# EAGLE design Triple Micro Shield (EAGLE 9.6.2)
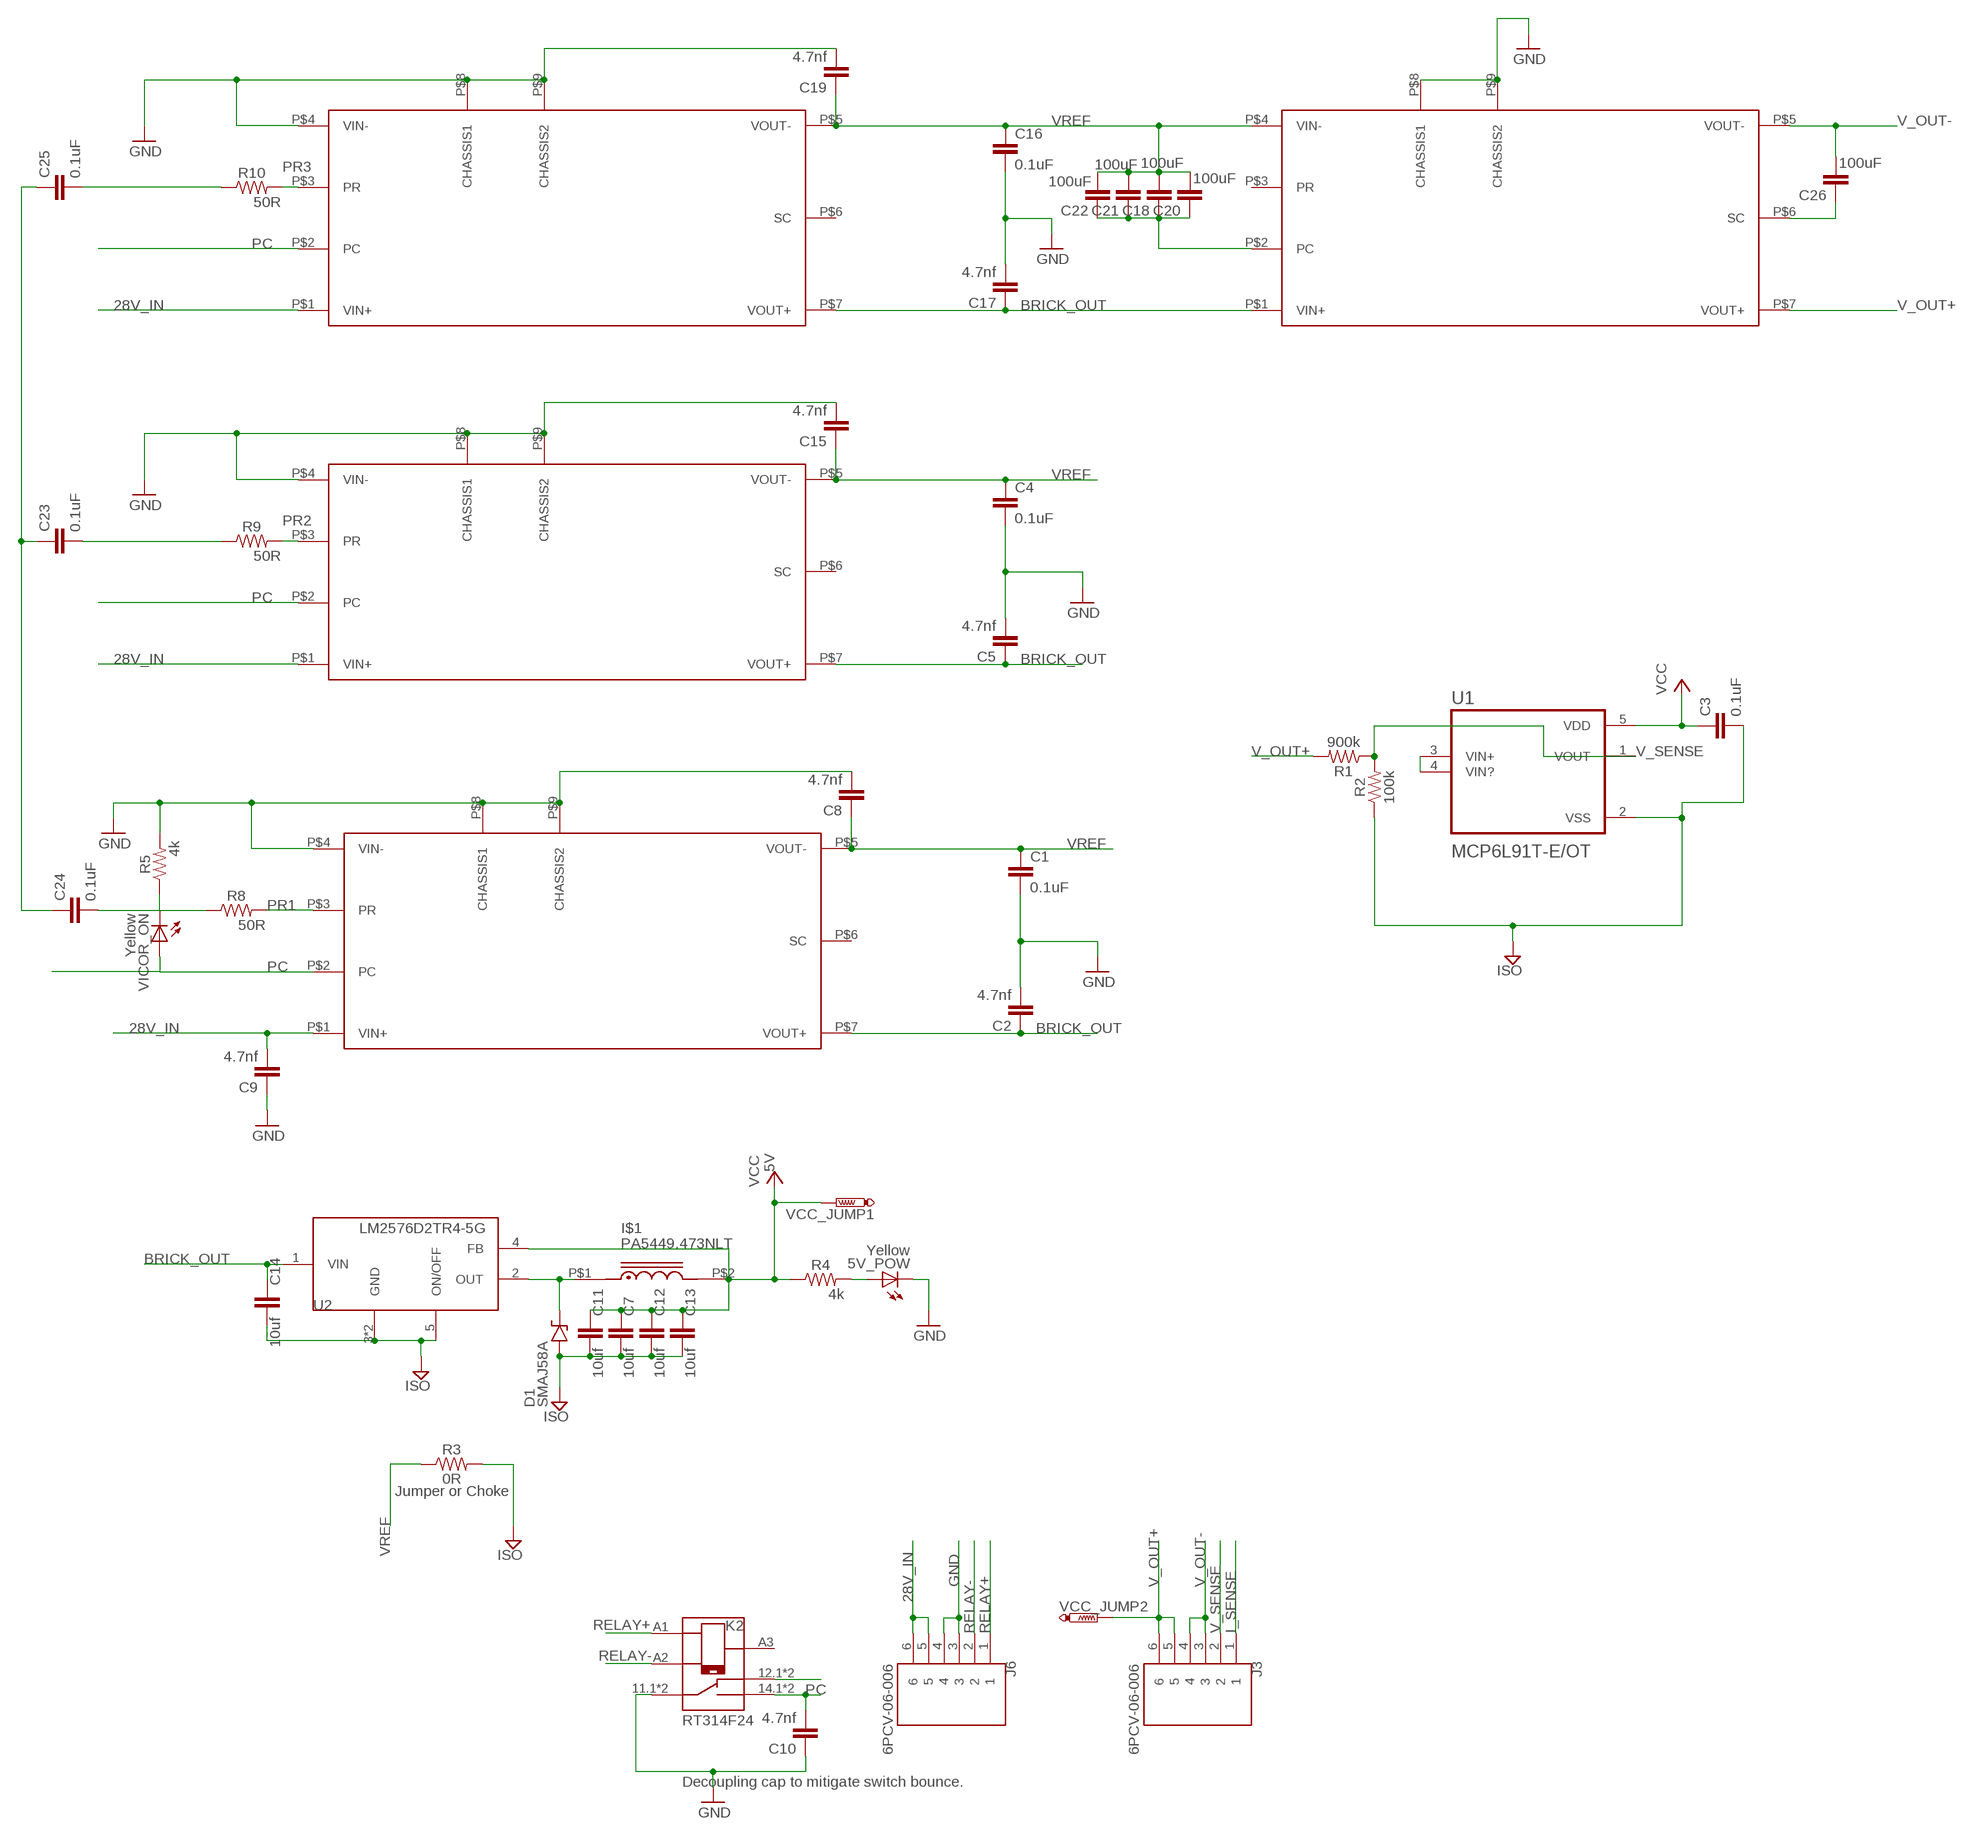
[diagram p0: schematic, sheet 1]

## Parts
5V_POW  Yellow  0044_KPT-2012YC  [CHIPLED_0805]
C1  0.1uF  5.6NF/5600PF_0603_50V_5%  [0603]
C2  4.7nf  5.6NF/5600PF_0603_50V_5%  [0603]
C3  0.1uF  5.6NF/5600PF_0603_50V_5%  [0603]
C4  0.1uF  5.6NF/5600PF_0603_50V_5%  [0603]
C5  4.7nf  5.6NF/5600PF_0603_50V_5%  [0603]
C7  10uf  39NF-0805-50V-10%  [0805]
C8  4.7nf  5.6NF/5600PF_0603_50V_5%  [0603]
C9  4.7nf  5.6NF/5600PF_0603_50V_5%  [0603]
C10  4.7nf  5.6NF/5600PF_0603_50V_5%  [0603]
C11  10uf  39NF-0805-50V-10%  [0805]
C12  10uf  39NF-0805-50V-10%  [0805]
C13  10uf  39NF-0805-50V-10%  [0805]
C14  10uf  39NF-0805-50V-10%  [0805]
C15  4.7nf  5.6NF/5600PF_0603_50V_5%  [0603]
C16  0.1uF  5.6NF/5600PF_0603_50V_5%  [0603]
C17  4.7nf  5.6NF/5600PF_0603_50V_5%  [0603]
C18  100uF  5.6NF/5600PF_0603_50V_5%  [0603]
C19  4.7nf  5.6NF/5600PF_0603_50V_5%  [0603]
C20  100uF  5.6NF/5600PF_0603_50V_5%  [0603]
C21  100uF  5.6NF/5600PF_0603_50V_5%  [0603]
C22  100uF  5.6NF/5600PF_0603_50V_5%  [0603]
C23  0.1uF  5.6NF/5600PF_0603_50V_5%  [0603]
C24  0.1uF  5.6NF/5600PF_0603_50V_5%  [0603]
C25  0.1uF  5.6NF/5600PF_0603_50V_5%  [0603]
C26  100uF  5.6NF/5600PF_0603_50V_5%  [0603]
D1  SMAJ58A  [SMA]
I$1  PA5449.473NLT  PULSE_ELECTRONICS_INDUCTOR  [IND_TYS4020470M-10]
J3  6PCV-06-006  [TE_9-1437652-5]
J6  6PCV-06-006  [TE_9-1437652-5]
K2  RT314F24  8-1393239-8  [TE_8-1393239-8]
R1  900k  1.8MOHM  [0603]
R2  100k  1.8MOHM  [0603]
R3  0R  1.8MOHM  [0603]
R4  4k  1.8MOHM  [0603]
R5  4k  1.8MOHM  [0603]
R8  50R  1.8MOHM  [0603]
R9  50R  1.8MOHM  [0603]
R10  50R  1.8MOHM  [0603]
U1  MCP6L91T-E/OT  [SOT95P270X145-5N]
U2  LM2576D2TR4-5G  [D2PAK-5]
U$2  VICOR_MINI_BRICK_VICORMINIBRICK  [VICOR_MINI_BRICK_MINIBRICK]
U$3  VICOR_MINI_BRICK_VICORMINIBRICK  [VICOR_MINI_BRICK_MINIBRICK]
U$4  VICOR_MINI_BRICK_VICORMINIBRICK  [VICOR_MINI_BRICK_MINIBRICK]
U$5  VICOR_MINI_BRICK_VICORMINIBRICK  [VICOR_MINI_BRICK_MINIBRICK]
VCC_JUMP1  PTR1PAD1-13  [P1-13]
VCC_JUMP2  PTR1PAD1-13  [P1-13]
VICOR_ON  Yellow  0044_KPT-2012YC  [CHIPLED_0805]

## Nets
28V_IN: C9.2 J6.5 J6.6 U$2.P$1(VIN+) U$3.P$1(VIN+) U$4.P$1(VIN+)
AGND: C3.2 C7.2 C11.2 C12.2 C13.2 C14.2 D1.A R2.1 R3.2 U1.2(VSS) U2.3(GND) U2.5(ON/OFF) U2.6(GND) ; supply symbol labelled ISO
BRICK_OUT: C2.1 C5.1 C14.1 C17.1 U2.1(VIN) U$2.P$7(VOUT+) U$3.P$7(VOUT+) U$4.P$7(VOUT+) U$5.P$1(VIN+)
GND: 5V_POW.C C1.2 C2.2 C4.2 C5.2 C8.2 C9.1 C10.1 C15.2 C16.2 C17.2 C19.2 J6.3 J6.4 K2.11.1 K2.11.2 R5.2 U$2.P$4(VIN-) U$2.P$8(CHASSIS1) U$2.P$9(CHASSIS2) U$3.P$4(VIN-) U$3.P$8(CHASSIS1) U$3.P$9(CHASSIS2) U$4.P$4(VIN-) U$4.P$8(CHASSIS1) U$4.P$9(CHASSIS2) U$5.P$8(CHASSIS1) U$5.P$9(CHASSIS2)
I_SENSE: J3.1
IN+: R1.1 R2.2 U1.1(VOUT)
N$1: K2.12.1 K2.12.2
N$2: 5V_POW.A R4.2
N$3: R5.1 VICOR_ON.C
N$4: C18.1 C20.1 C21.1 C22.1 U$5.P$2(PC)
N$5: D1.C I$1.P$1 U2.2(OUT)
N$6: C23.2 R9.1
N$7: C23.1 C24.1 C25.1
N$8: C24.2 R8.1
N$9: C25.2 R10.1
N$12: C26.1 U$5.P$6(SC)
PC: C10.2 K2.14.1 K2.14.2 U$2.P$2(PC) U$3.P$2(PC) U$4.P$2(PC) VICOR_ON.A
PR1: R8.2 U$2.P$3(PR)
PR2: R9.2 U$3.P$3(PR)
PR3: R10.2 U$4.P$3(PR)
RELAY+: J6.1 K2.A1
RELAY-: J6.2 K2.A2
V_OUT+: J3.5 J3.6 R1.2 U$5.P$7(VOUT+) VCC_JUMP2.TP
V_OUT-: C26.2 J3.3 J3.4 U$5.P$5(VOUT-)
V_SENSE: J3.2 U1.3(VIN+) U1.4(VIN?)
VCC: C3.1 C7.1 C11.1 C12.1 C13.1 I$1.P$2 R4.1 U1.5(VDD) U2.4(FB) VCC_JUMP1.TP
VREF: C1.1 C4.1 C8.1 C15.1 C16.1 C18.2 C19.1 C20.2 C21.2 C22.2 R3.1 U$2.P$5(VOUT-) U$3.P$5(VOUT-) U$4.P$5(VOUT-) U$5.P$4(VIN-)
Unconnected: K2.A3 U$2.P$6(SC) U$3.P$6(SC) U$4.P$6(SC) U$5.P$3(PR)

## Notes on the sheet
- 5V
- Jumper or Choke
- Decoupling cap to mitigate switch bounce.

## Library data of the parts
5V_POW VICOR_ON = Opto:0044_KPT-2012YC: LED YELLOW - SMD - 0805; MONTHLY_USAGE: _____; PART_NUMBER: KPT-2012YC; PRICE: _____; SUPPLIER: _____; TYPE: Opto
C1-C5 C8-C10 C15-C26 = SparkFun-Capacitors:5.6NF/5600PF: 5.6nF/5600pF ceramic capacitors A capacitor is a passive two-terminal electrical component used to store electrical energy temporarily in an electric field.; PROD_ID: CAP-16058; VALUE: 5.6nF
C7 C11-C14 = SparkFun-Capacitors:39NF: 39nF ceramic capacitors A capacitor is a passive two-terminal electrical component used to store electrical energy temporarily in an electric field.; PROD_ID: CAP-15816; VALUE: 39nF
D1 = SMAJ58A:SMAJ58A: Check prices <https://pricing.snapeda.com/parts/SMAJ58A/Littelfuse%20Inc./view-part?ref=eda>; AVAILABILITY: Good; DESCRIPTION: 93.6V Clamp 4.3A Ipp Tvs Diode Surface Mount DO-214AC (SMA); MF: Littelfuse Inc.; MP: SMAJ58A; PACKAGE: DO-214AC-214 Littelfuse Inc.; PRICE: None; PURCHASE-URL: https://pricing.snapeda.com/search/part/SMAJ58A/?ref=eda
I$1 = pulse_electronics_inductor:PULSE_ELECTRONICS_INDUCTOR
J3 J6 = 6PCV-06-006:6PCV-06-006: Check availability <https://pricing.snapeda.com/parts/6PCV-06-006/TE%20Connectivity/view-part?ref=eda>; AVAILABILITY: In Stock; COMMENT: 9-1437652-5; DESCRIPTION: Buchanan 6 Position 9.53 mm Pitch Single Row 12-22 AWG Tri-Barrier Strip; MF: TE Connectivity; MP: 6PCV-06-006; PACKAGE: None; PRICE: None; PURCHASE-URL: https://pricing.snapeda.com/search/part/6PCV-06-006/?ref=eda
K2 = 8-1393239-8:8-1393239-8: General Purpose Relay SPDT (1 Form C) 24VDC Coil Through Hole Check prices <https://pricing.snapeda.com/parts/RT314F24/TE%20Connectivity/view-part?ref=eda>; AVAILABILITY: In Stock; COMMENT: 8-1393239-8; DESCRIPTION: General Purpose Relay, Power PCB Relay RT1 Series, Power, Latching Dual Coil, SPDT, 24 VDC, 16 A; MF: TE Connectivity; MP: RT314F24; PACKAGE: None; PRICE: None; PURCHASE-URL: https://pricing.snapeda.com/search/part/RT314F24/?ref=eda
R1-R5 R8-R10 = SparkFun-Resistors:1.8MOHM: 1.8 MOhms ±5% 0.1W, 1/10W Chip Resistor 0603; PROD_ID: RES-13994; VALUE: 1.8M
U1 = MCP6L91T-E_OT-SINGLE:MCP6L91T-E/OT: Check prices <https://pricing.snapeda.com/parts/MCP6L91T-E/OT/Microchip%20Technology/view-part?ref=eda>; AVAILABILITY: In Stock; DESCRIPTION: General Purpose Amplifier 1 Circuit Rail-to-Rail SOT-23-5; MF: Microchip Technology; MP: MCP6L91T-E/OT; PACKAGE: SOT-23-5 Microchip; PRICE: None; PURCHASE-URL: https://pricing.snapeda.com/search/part/MCP6L91T-E/OT/?ref=eda
U2 = LM2576D2TR4-5G:LM2576D2TR4-5G: http://octopart.com/lm2576d2tr4-5g-on+semiconductor-46514222 Check prices <https://pricing.snapeda.com/parts/LM2576D2TR4-5G/ON%20Semiconductor/view-part?ref=eda>; AVAILABILITY: In Stock; DESCRIPTION: Buck Switching Regulator IC Positive or Negative Fixed 5V 1 Output 3A TO-263-6, D²Pak (5 Leads + Tab), TO-263BA; MF: ON Semiconductor; MP: LM2576D2TR4-5G; PACKAGE: D2PAK-5 ON Semiconductor; PRICE: None; PURCHASE-URL: https://pricing.snapeda.com/search/part/LM2576D2TR4-5G/?ref=eda
U$2-U$5 = Triple Mini Shield:VICOR_MINI_BRICK_VICORMINIBRICK
VCC_JUMP1 VCC_JUMP2 = testpad:PTR1: TEST PIN

## Board
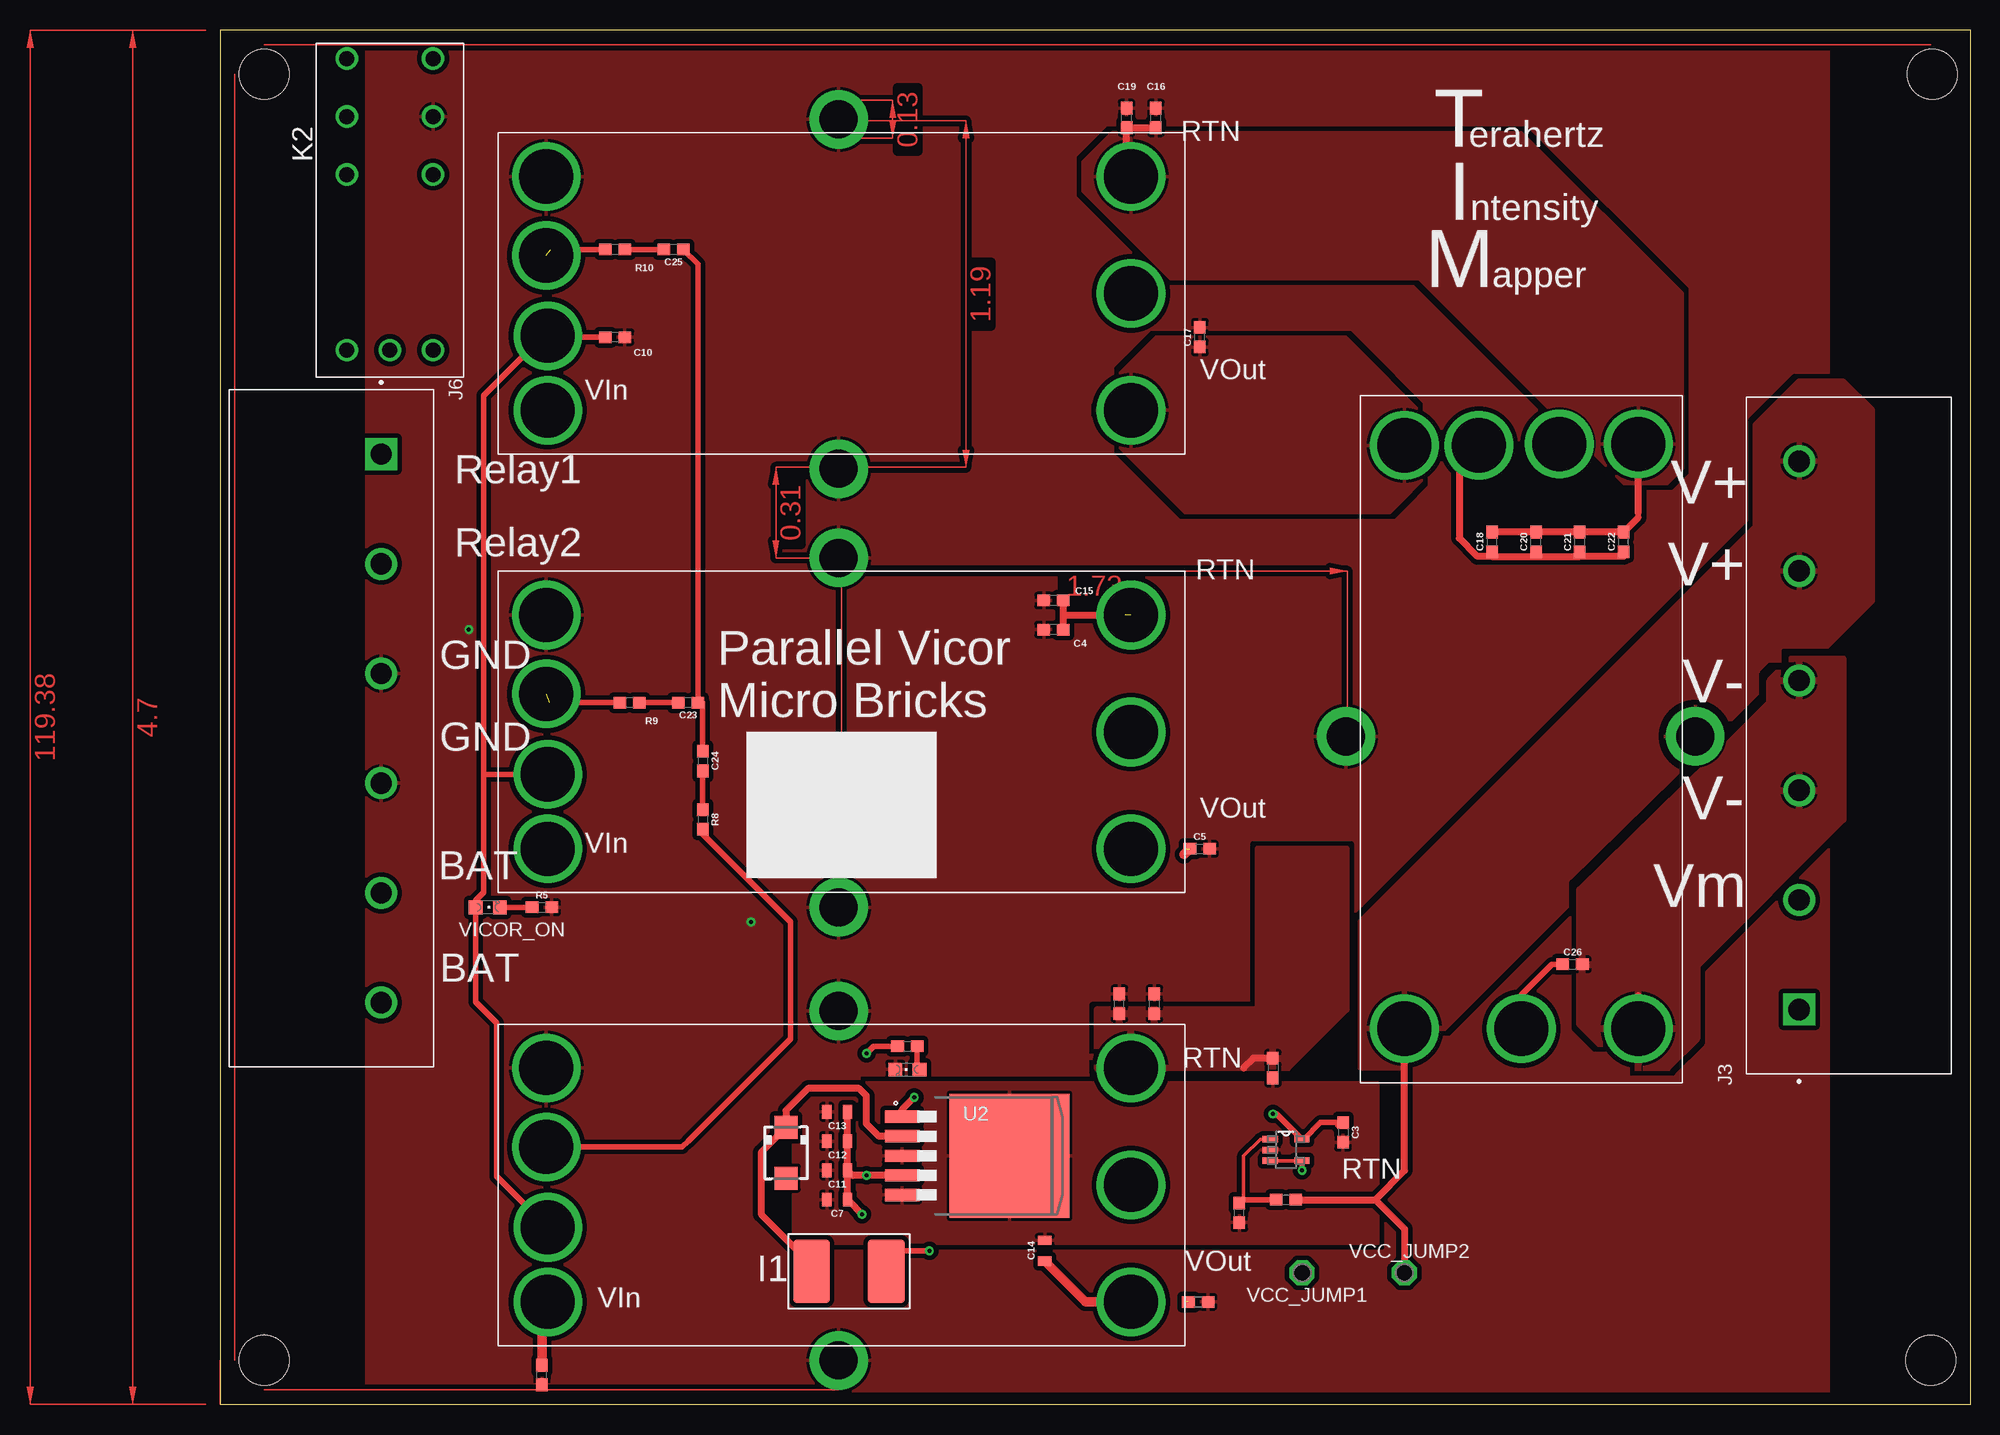
[diagram p1: board, top side]
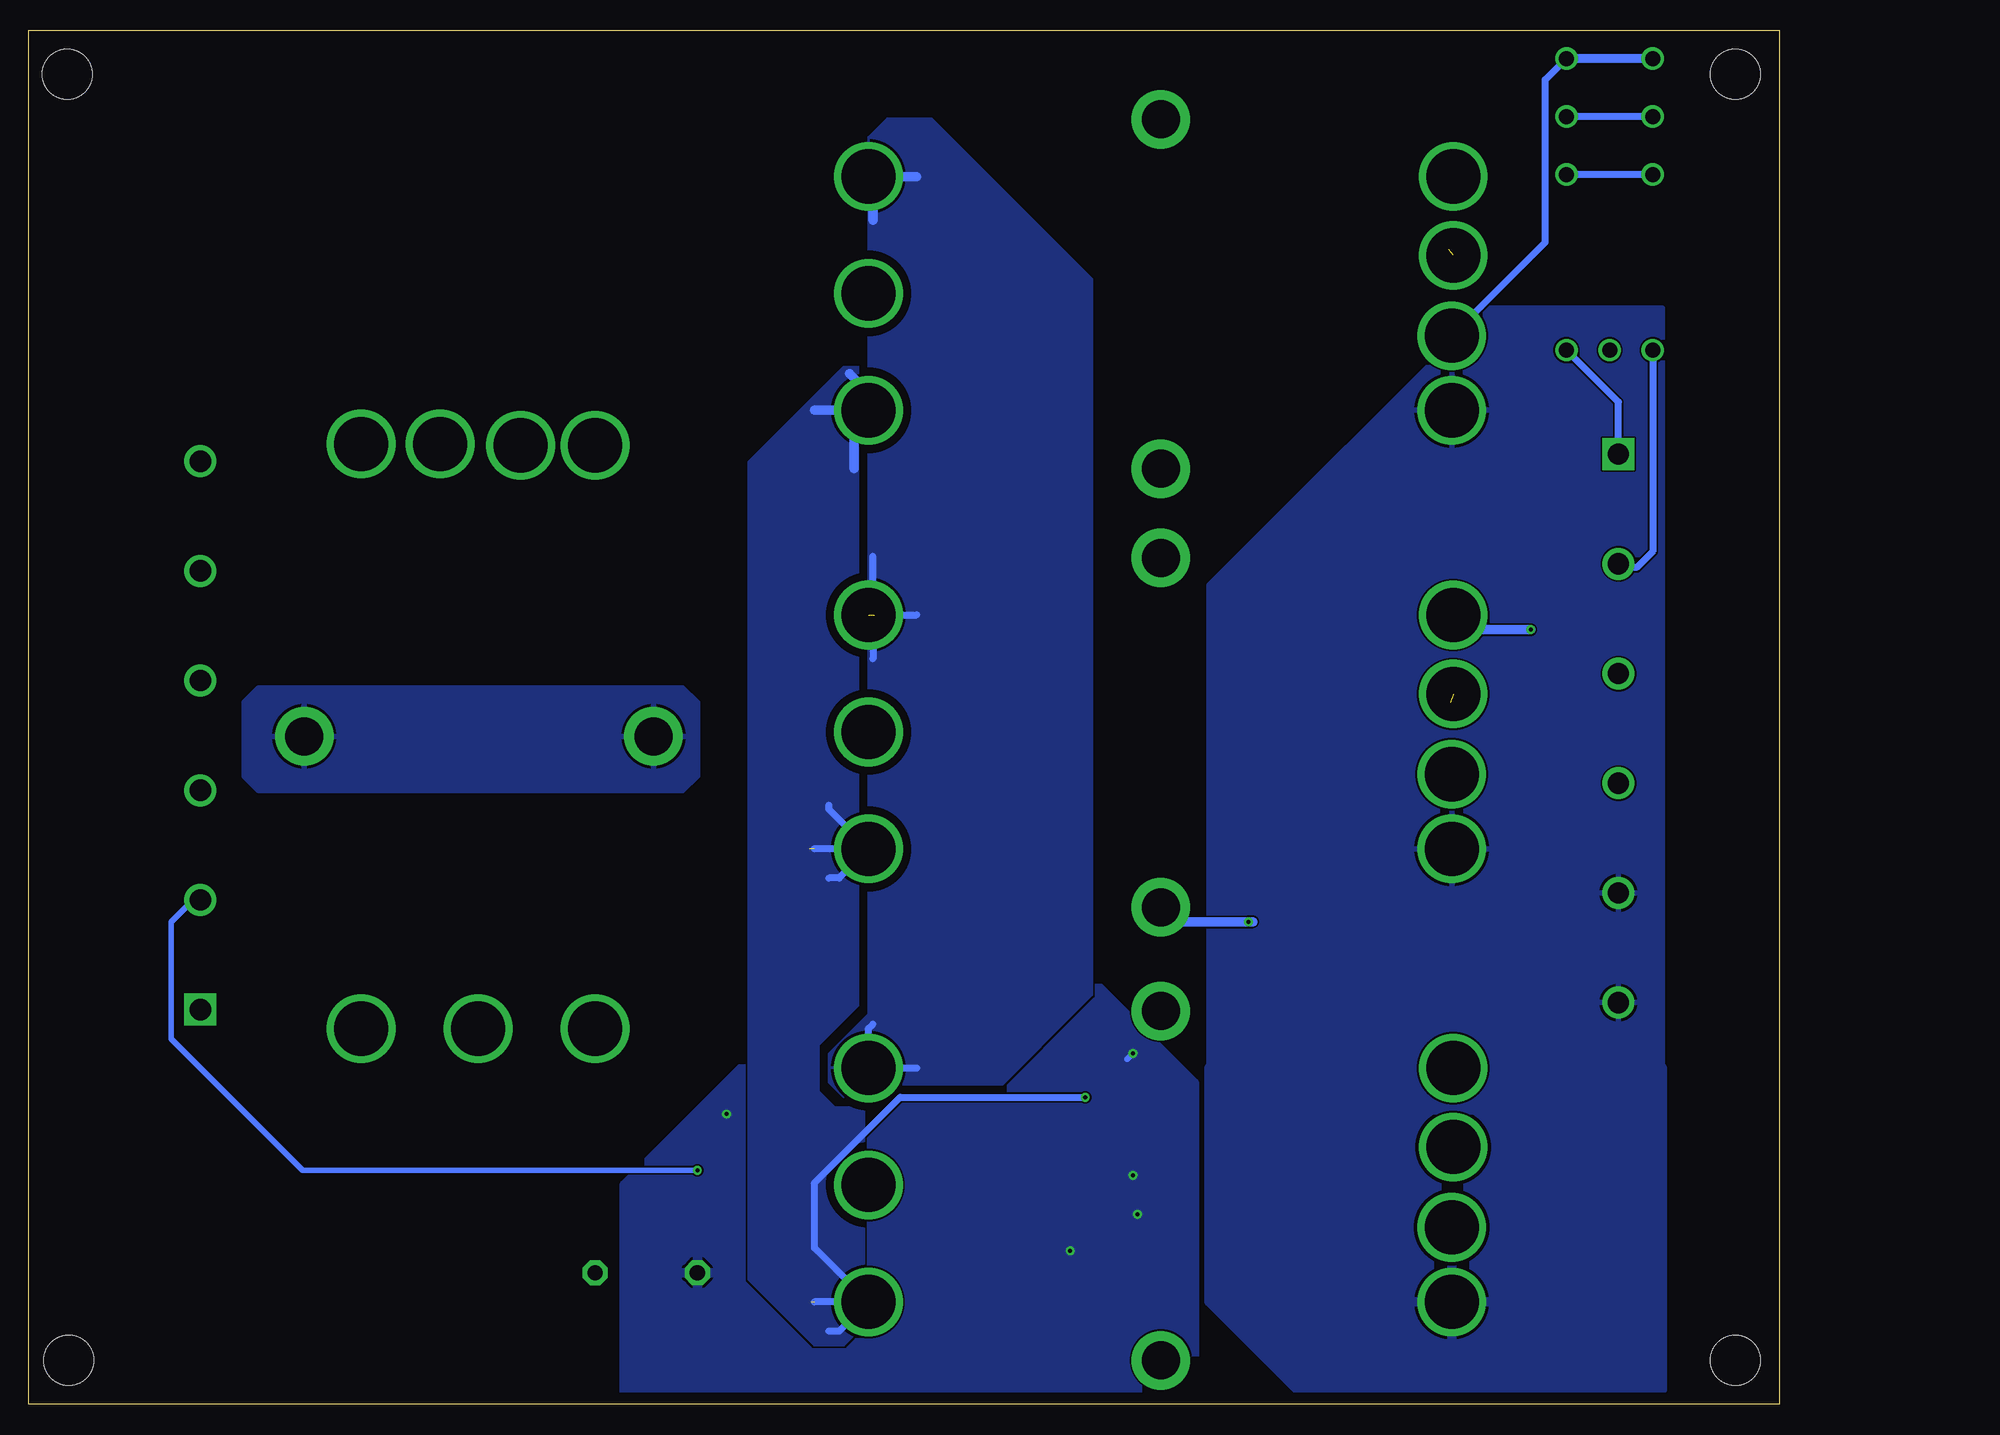
[diagram p2: board, bottom side, seen from below]

Size 152.07 x 119.37 mm. Coordinates in mm from the lower left corner, seen from the top.
Outline: 0,0 152.07,0 152.07,119.37 0,119.37 0,0
Copper layers (1*16): Top 0.035mm / dielectric 1.5mm / Bottom 0.035mm
Design rules "default": minimum track width 6mil, minimum drill 0.35mm, track to track 6mil, track to pad 6mil, pad to pad 6mil, via to via 6mil, smd to smd 6mil, copper to edge 40mil, drill to drill 6mil, minimum pad ring 10mil, minimum via ring 8mil, stop-mask expansion 4mil, vias tented up to drill 0mil, thermal gap 10mil
Holes 4.32 mm at 3.81,115.57 148.59,3.81 3.81,3.81 148.72,115.57

### Footprints (pad centres in the part's own frame; a part is rotated, then mirrored left to right if it is on the bottom)
CHIPLED_0805 = smd 1.2 x 1.2: A 0,-1.05; C 0,1.05
0603 = smd 1.1 x 1: 1 -0.85,0; 2 0.85,0
0805 = smd 0.8 x 1.2: 1 -0.9,0; 2 0.9,0
SMA = smd 2 x 2: A 2.2,0; C -2.2,0
IND_TYS4020470M-10 = smd 3.2 x 5.5: P$1 -3.5,0; P$2 3,0
TE_9-1437652-5 = drill 1.854 pad 2.204 square: 1 0,0 | drill 1.854 pad 2.204: 2 9.53,0; 3 19.06,0; 4 28.59,0; 5 38.12,0; 6 47.65,0
TE_8-1393239-8 = drill 1.3: 11.1 0,-3.75; 11.2 0,3.75; 12.1 -5.04,-3.75; 12.2 -5.04,3.75; 14.1 5.04,-3.75; 14.2 5.04,3.75; A1 -20.3,-3.75; A2 -20.3,3.75; A3 -20.3,0
SOT95P270X145-5N = smd 1.321 x 0.559: 1 -1.372,0.94; 2 -1.372,0; 3 -1.372,-0.94; 4 1.372,-0.94; 5 1.372,0.94
D2PAK-5 = smd 3 x 1.067: 1 -4.521,3.404; 2 -4.521,1.702; 3 -4.521,0; 4 -4.521,-1.702; 5 -4.521,-3.404 | smd 10.41 x 10.8: 6 4.81,0
VICOR_MINI_BRICK_MINIBRICK = drill 4.699 pad 5.969: P$1 -26.162,13.97; P$2 -26.162,20.447; P$3 -26.289,27.432; P$4 -26.289,34.29; P$5 24.511,34.29; P$6 24.511,24.13; P$7 24.511,13.97 | drill 3.302 pad 5.08: P$8 -0.889,39.243; P$9 -0.889,8.89
P1-13 = drill 1.321 pad 2.159 octagon: TP 0,0

### Placement (x,y rotation side)
5V_POW  59.69,29.08 90 top
C1  78.11,34.8 90 top
C2  84.96,8.89 0 top
C3  97.54,23.62 270 top
C4  72.39,67.31 180 top
C5  85.09,48.26 0 top
C7  53.59,17.78 180 top
C8  81.15,34.8 90 top
C9  27.94,2.54 90 top
C10  34.29,92.71 180 top
C11  53.59,20.32 180 top
C12  53.59,22.86 180 top
C13  53.59,25.4 180 top
C14  71.63,13.33 90 top
C15  72.39,69.85 180 top
C16  81.28,111.76 90 top
C17  85.09,92.71 90 top
C18  110.49,74.93 90 top
C19  78.74,111.76 90 top
C20  114.3,74.93 90 top
C21  118.11,74.93 90 top
C22  121.92,74.93 90 top
C23  40.64,60.96 180 top
C24  41.91,55.88 270 top
C25  39.37,100.33 180 top
C26  117.47,38.23 0 top
D1  49.15,21.84 270 top
I$1  54.86,11.56 0 top
J3  137.16,34.29 90 top
J6  13.97,82.55 270 top
K2  14.73,111.89 90 top
R1  92.58,17.78 0 top
R2  88.52,16.64 90 top
R3  91.44,29.21 270 top
R4  59.69,31.11 0 top
R5  27.94,43.18 0 top
R8  41.91,50.8 270 top
R9  35.56,60.96 180 top
R10  34.29,100.33 180 top
U1  92.58,22.1 0 top
U2  63.75,21.59 0 top
U$2  54.61,-5.08 0 top
U$3  54.61,34.29 0 top
U$4  54.61,72.39 0 top
U$5  88.9,57.15 270 top
VCC_JUMP1  93.98,11.43 0 top
VCC_JUMP2  102.87,11.43 0 top
VICOR_ON  23.24,43.18 270 top

### Tracks (layer width: path | path; a pad name or v marks a point on that pad's centre or on a via)
28V_IN
  Top 0.61: U$2.P$1 27.94,8.38
  Top 0.813: 27.94,8.38 C9.2
  pour Bottom (isolate 0.305): 10.16,29.21 10.16,1.27 41.91,1.27 49.53,8.89 49.53,29.21
  pour Bottom: 49.53,26.67 49.53,71.12 25.4,95.25 10.16,95.25 10.16,27.94 12.7,25.4 48.26,25.4
AGND
  pour Top (isolate 0.406): 49.78,27.94 100.58,27.94 100.58,13.97 49.78,13.97
BRICK_OUT  (via drill 0.35)  (2 unrouted)
  Top 0.61: U2.1 59.23,25.61 v60.29,26.67
  Top 0.813: C5.1 83.73,47.75 | C14.1 75.17,8.89 U$2.P$7
  Bottom 0.61: v60.29,26.67 76.37,26.67 83.82,19.22 83.82,13.59 U$2.P$7 | U$2.P$7 83.82,8.89 | U$2.P$7 81.66,6.35 82.55,6.35 | U$3.P$7 83.82,48.26 | U$3.P$7 82.55,51.69 82.55,52.07 | U$3.P$7 81.66,45.72 82.55,45.72 | U$4.P$7 82.55,86.36
  Bottom 0.813: U$4.P$7 83.82,86.36 | U$4.P$7 80.39,85.09 80.39,81.28 | U$4.P$7 79.12,87.88 80.77,89.53
  pour Bottom (isolate 0.711, rank 2): 79.5,90.17 79.5,6.86 81.28,5.08 83.82,5.08 89.53,10.79 89.53,81.91 81.28,90.17
  pour Top: 81.28,92.71 97.79,92.71 105.41,85.09 105.41,81.28 101.6,77.47 83.82,77.47 76.2,85.09 76.2,87.63
GND  (via drill 0.35)
  Bottom 0.61: K2.11.2 K2.11.1
  Bottom 0.813: U$3.P$4 27.05,67.31 v21.59,67.31 | U$3.P$9 52.45,41.91 v46.1,41.91 45.72,41.91
  pour Top (isolate 0.406, rank 6): 13.97,120.65 139.7,120.65 139.7,-3.81 12.7,-3.81 12.7,119.38
  pour Bottom (rank 2): 95.25,62.23 93.98,60.96 93.98,54.61 95.25,53.34 96.52,53.34 132.08,53.34 133.35,54.61 133.35,58.42 133.35,60.96 132.08,62.23
IN+
  Top 0.305: R2.2 88.9,17.87 88.9,21.59 90.35,23.04 U1.1
  Top 0.457: R1.1 88.81,17.78 R2.2
N$1
  Bottom 0.61: K2.12.2 K2.12.1
N$2
  Top 0.457: 5V_POW.A 60.54,29.28 R4.2
N$3
  Top 0.457: R5.1 VICOR_ON.C
N$4
  Top 0.61: 110.49,73.66 109.22,73.66 107.63,75.25 107.63,81.6 U$5.P$2 | 110.49,73.66 114.3,73.66 | 114.3,73.66 118.11,73.66 | 118.11,73.66 121.92,73.66 C22.1 | C21.1 118.11,73.66 | C20.1 114.3,73.66 | C18.1 110.49,73.66
N$5
  Top 0.61: U2.2 57.23,23.29 56.13,24.38 56.13,26.8 55.5,27.43 51.05,27.43 49.15,25.53 D1.C 46.99,21.88 46.99,16.51 51.36,12.14 I$1.P$1
N$6
  Top 0.457: R9.1 C23.2
N$7
  Top 0.457: C24.1 41.91,60.96 C23.1 41.49,99.06 C25.1
N$8
  Top 0.457: R8.1 C24.2
N$9
  Top 0.457: R10.1 C25.2
N$12
  Top 0.457: U$5.P$6 113.03,35.56 115.7,38.23 C26.1
PC
  Top 0.457: U$2.P$2 24,19.81 24,33.15 22.19,34.96 VICOR_ON.A 22.19,43.78 22.86,44.45 22.86,54.61 | 22.86,54.61 22.86,87.63 27.94,92.71 C10.2 28.58,92.71 U$4.P$2 | U$3.P$2 22.99,54.74 22.86,54.61
  Top 0.61: U$2.P$2 30.35,15.37
  Bottom 0.61: U$4.P$2 20.32,100.96 20.32,115.09 K2.14.1
  Bottom 0.762: K2.14.2 K2.14.1
PR1
  Top 0.457: R8.2 41.91,49.53 49.53,41.91 49.53,31.75 40.64,22.86 40.13,22.35 U$2.P$3
PR2  (1 unrouted)
  Top 0.457: R9.2 28.58,60.96
PR3  (1 unrouted)
  Top 0.457: 28.7,100.33 R10.2
RELAY+
  Bottom 0.61: J6.1 13.97,87.08 K2.A1
RELAY-
  Bottom 0.457: J6.2 13.66,72.7
  Bottom 0.61: K2.A2 10.98,74.11 12.38,72.7 13.66,72.7
V_OUT+
  Top 0.61: R1.2 100.33,17.78 | 100.33,17.78 102.87,20.32 102.87,33.02 | 100.33,17.78 102.87,15.24 VCC_JUMP2.TP
  pour Top (isolate 0.61, rank 2): 102.87,29.21 99.06,29.21 99.06,41.91 133.35,76.2 133.35,85.09 137.16,88.9 140.97,88.9 143.51,86.36 143.51,69.85
V_OUT-
  Top 0.457: U$5.P$5 123.19,35.56
  pour Top: 125.73,29.21 121.92,29.21 118.11,33.02 118.11,44.7 129.54,55.88 134.62,60.96 134.62,62.87 136.53,64.77 140.97,64.77 140.97,50.8 128.27,38.1 128.27,31.75
V_SENSE  (via drill 0.35)
  Top 0.305: U1.3 U1.4
  Top 0.457: 94.03,21.08 U1.4 93.98,21.13 v93.98,20.32
  Bottom 0.457: J3.2 137.79,43.82 139.7,41.91 139.7,31.75 128.27,20.32 v93.98,20.32
VCC  (via drill 0.35)
  Top 0.457: v56.13,30.48 56.77,31.11 R4.1 | 97.1,24.25 C3.1 95.59,24.47 94.16,23.04 U1.5 91.77,25.22 v91.44,25.22 | v61.59,13.33 59.05,13.33 58.29,12.57 58.29,11.56
  Top 0.61: U2.4 v56.13,19.89 54.93,19.89 C11.1 | C11.1 C7.1 54.61,17.66 | C11.1 C12.1 C13.1 | 54.61,17.66 v55.75,16.52 v55.75,16.51 | 54.49,17.66 54.61,17.66 | 58.29,11.56 I$1.P$2
  Bottom 0.457: v56.13,30.48 56.64,29.97
  pour Bottom (rank 3): 80.01,39.37 62.23,39.37 50.8,27.94 50.8,-2.54 59.69,-11.43 92.71,-11.43 100.33,-3.81 100.33,19.05
VREF  (1 unrouted)
  Top 0.457: 123.19,77.05 123.19,77.47 | 123.19,82.55 U$5.P$4
  Top 0.61: 123.19,77.05 C22.2 C21.2 C20.2 C18.2 | C1.1 78.07,33.91 | R3.1 89.75,30.06 88.9,29.21 | 81.19,33.91 C8.1 | C4.1 73.24,68.58 | 73.24,68.58 C15.1 | 73.24,68.58 78.61,68.58 | 123.19,77.47 123.19,82.55 | U$4.P$5 78.74,107.06 C19.1 C16.1
  Bottom 0.61: 74.93,29.21 U$2.P$5 79.12,32.64 78.74,33.02 | U$3.P$5 74.93,68.58 | U$3.P$5 78.74,68.96 78.74,73.66 | U$3.P$5 78.74,68.2 78.74,64.77
  Bottom 0.813: 74.93,106.68 78.74,106.68 78.74,106.3 | 78.74,106.3 U$4.P$5 78.74,107.06 78.74,109.22 | 78.74,106.3 78.74,102.87
  pour Bottom (isolate 0.711): 79.12,33.91 79.12,110.11 77.47,111.76 73.66,111.76 59.69,97.79 59.69,35.56 68.58,26.67 81.28,26.67 82.55,27.94 82.55,30.48
  pour Top: 77.47,110.49 113.03,110.49 127,96.52 127,81.28 125.73,80.01 121.92,80.01 104.14,97.79 82.55,97.79 74.93,105.41 74.93,107.95
  pour Top: 92.71,29.21 76.2,29.21 76.2,34.29 90.17,34.29 90.17,48.26 97.79,48.26 97.79,34.29
(copper drawn outside any net)
  shapes: Top area x13

### Text on the board
tPlace: T | erahertz | I | ntensity | M | apper | I1
tNames: RTN | VIn | VOut | Relay1 | V+ | Relay2 | RTN | V+ | GND | V- | Parallel Vicor / Micro Bricks | GND | VOut | V- | VIn | BAT | Vm | BAT | RTN | RTN | VOut | VIn
tValues: Gnd | PR | Trim | PC | Gnd | PR | Trim | PC | Filter | MicroRAM | Gnd | BoB V OUT | BoB RTN | Trim | PR | Diode | PC